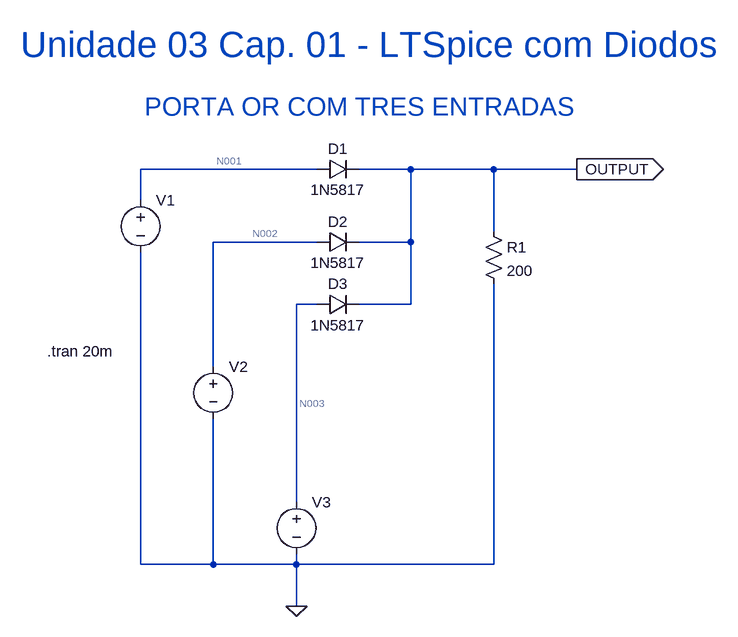
[diagram p0: schematic LTSpice_porta_or_tres_entradas.asc]
LTSpice_porta_or_tres_entradas.asc, the LTspice schematic file:
Version 4.1
SHEET 1 880 820
WIRE 208 128 -64 128
WIRE 352 128 272 128
WIRE 480 128 352 128
WIRE 608 128 480 128
WIRE -64 176 -64 128
WIRE 480 224 480 128
WIRE 208 240 48 240
WIRE 352 240 352 128
WIRE 352 240 272 240
WIRE 208 336 176 336
WIRE 352 336 352 240
WIRE 352 336 272 336
WIRE 48 432 48 240
WIRE 176 640 176 336
WIRE -64 736 -64 256
WIRE 48 736 48 512
WIRE 48 736 -64 736
WIRE 176 736 176 720
WIRE 176 736 48 736
WIRE 480 736 480 304
WIRE 480 736 176 736
WIRE 176 800 176 736
FLAG 608 128 OUTPUT
IOPIN 608 128 Out
FLAG 176 800 0
SYMBOL diode 208 144 R270
WINDOW 0 32 32 VTop 2
WINDOW 3 0 32 VBottom 2
SYMATTR InstName D1
SYMATTR Value 1N5817
SYMBOL diode 208 256 R270
WINDOW 0 32 32 VTop 2
WINDOW 3 0 32 VBottom 2
SYMATTR InstName D2
SYMATTR Value 1N5817
SYMBOL voltage -64 160 R0
WINDOW 3 24 96 Invisible 2
WINDOW 123 0 0 Left 0
WINDOW 39 24 124 Left 2
SYMATTR Value PULSE(0 5 0 10n 10n 2.5m 5m)
SYMATTR InstName V1
SYMBOL res 464 208 R0
SYMATTR InstName R1
SYMATTR Value 200
SYMATTR SpiceLine tol=1 pwr=0.1
SYMBOL voltage 48 416 R0
WINDOW 3 24 96 Invisible 2
WINDOW 123 0 0 Left 0
WINDOW 39 0 0 Left 0
SYMATTR Value PULSE(0 5 1m 10n 10n 2.5m 5m)
SYMATTR InstName V2
SYMBOL voltage 176 624 R0
WINDOW 3 24 96 Invisible 2
WINDOW 123 0 0 Left 0
WINDOW 39 24 124 Left 2
SYMATTR Value PULSE(0 5 4m 10n 10n 2.5m 5m)
SYMATTR InstName V3
SYMBOL diode 208 352 R270
WINDOW 0 32 32 VTop 2
WINDOW 3 0 32 VBottom 2
SYMATTR InstName D3
SYMATTR Value 1N5817
TEXT 272 32 Center 4 ;PORTA OR COM TRES ENTRADAS
TEXT 288 -64 Center 5 ;Unidade 03 Cap. 01 - LTSpice com Diodos
TEXT -208 408 Left 2 !.tran 20m

The netlist it stands for:
* LTSpice_porta_or_tres_entradas.asc
D1 N001 OUTPUT 1N5817
D2 N002 OUTPUT 1N5817
V1 N001 0 PULSE(0 5 0 10n 10n 2.5m 5m)
R1 OUTPUT 0 200 tol=1 pwr=0.1
V2 N002 0 PULSE(0 5 1m 10n 10n 2.5m 5m)
V3 N003 0 PULSE(0 5 4m 10n 10n 2.5m 5m)
D3 N003 OUTPUT 1N5817
.model D D
.lib standard.dio
* PORTA OR COM TRES ENTRADAS
* Unidade 03 Cap. 01 - LTSpice com Diodos
.tran 20m
.backanno
.end

* Results of the author's LTspice run, read from the files saved beside the schematic
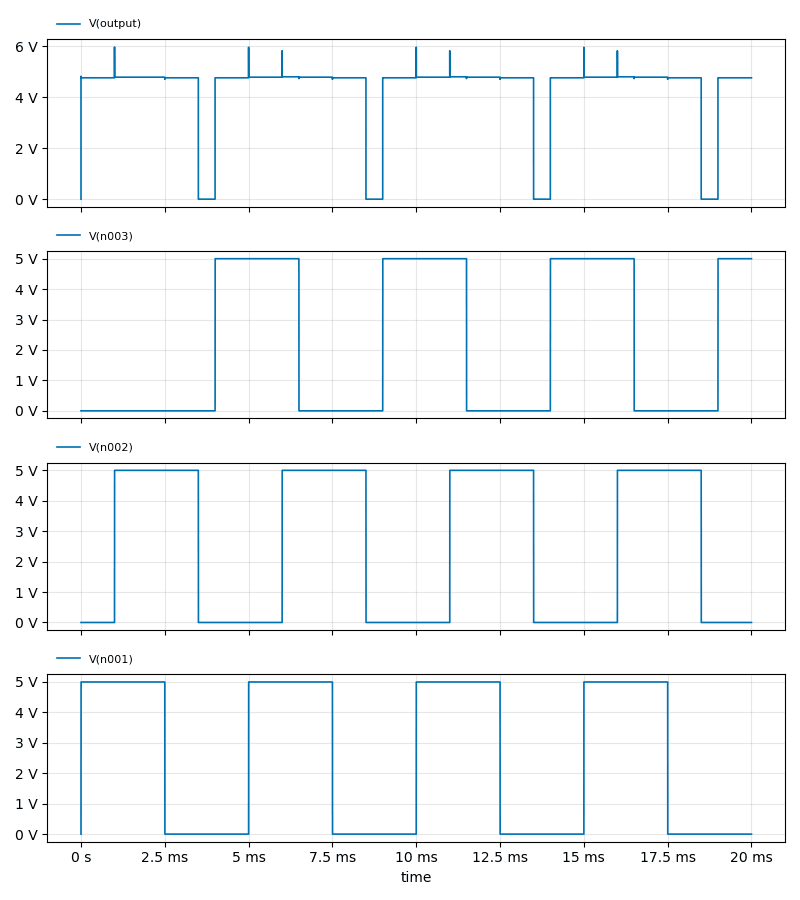
[diagram p1: Transient Analysis of LTSpice_porta_or_tres_entradas.asc, plotted from the saved traces]
* Transient Analysis, 1 run:
*   V(output): min -49.23 µV, max 5.971 V, average 4.299 V, rms 4.532 V, last 4.764 V
*   V(n003): min 0 V, max 5 V, average 2.125 V, rms 3.26 V, last 5 V
*   V(n002): min 0 V, max 5 V, average 2.5 V, rms 3.536 V, last 0 V
*   V(n001): min 0 V, max 5 V, average 2.5 V, rms 3.536 V, last 0 V